# EAGLE design lab3_task1 (EAGLE 6.5.0)
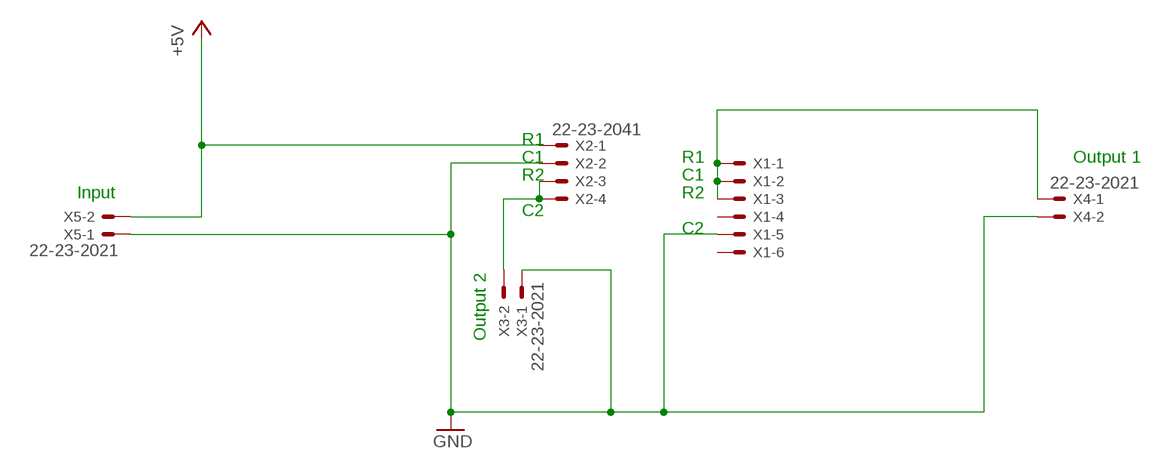
[diagram p0: schematic, sheet 1]

## Parts
X1  22-23-2061  [22-23-2061]
X2  22-23-2041  [22-23-2041]
X3  22-23-2021  [22-23-2021]
X4  22-23-2021  [22-23-2021]
X5  22-23-2021  [22-23-2021]

## Nets
+5V: X2.1 X5.2
GND: X1.5 X2.2 X3.1 X4.2 X5.1
N$1: X1.1 X1.2 X1.3 X4.1
N$2: X2.3 X2.4 X3.2
Unconnected: X1.4 X1.6

## Notes on the sheet
- R1
- C1 | R1 | Output 1
- R2 | C1
- Input | R2
- C2
- C2
- Output 2

## Library data of the parts
X1 = con-molex:22-23-2061: .100" (2.54mm) Center Header - 6 Pin; MF: MOLEX; MPN: 22-23-2061; OC_FARNELL: 1462922; OC_NEWARK: 27C1933
X2 = con-molex:22-23-2041: .100" (2.54mm) Center Header - 4 Pin; MF: MOLEX; MPN: 22-23-2041; OC_FARNELL: 1462920; OC_NEWARK: 38C0355
X3-X5 = con-molex:22-23-2021: .100" (2.54mm) Center Header - 2 Pin; MF: MOLEX; MPN: 22-23-2021; OC_FARNELL: 1462926; OC_NEWARK: 25C3832

## Board
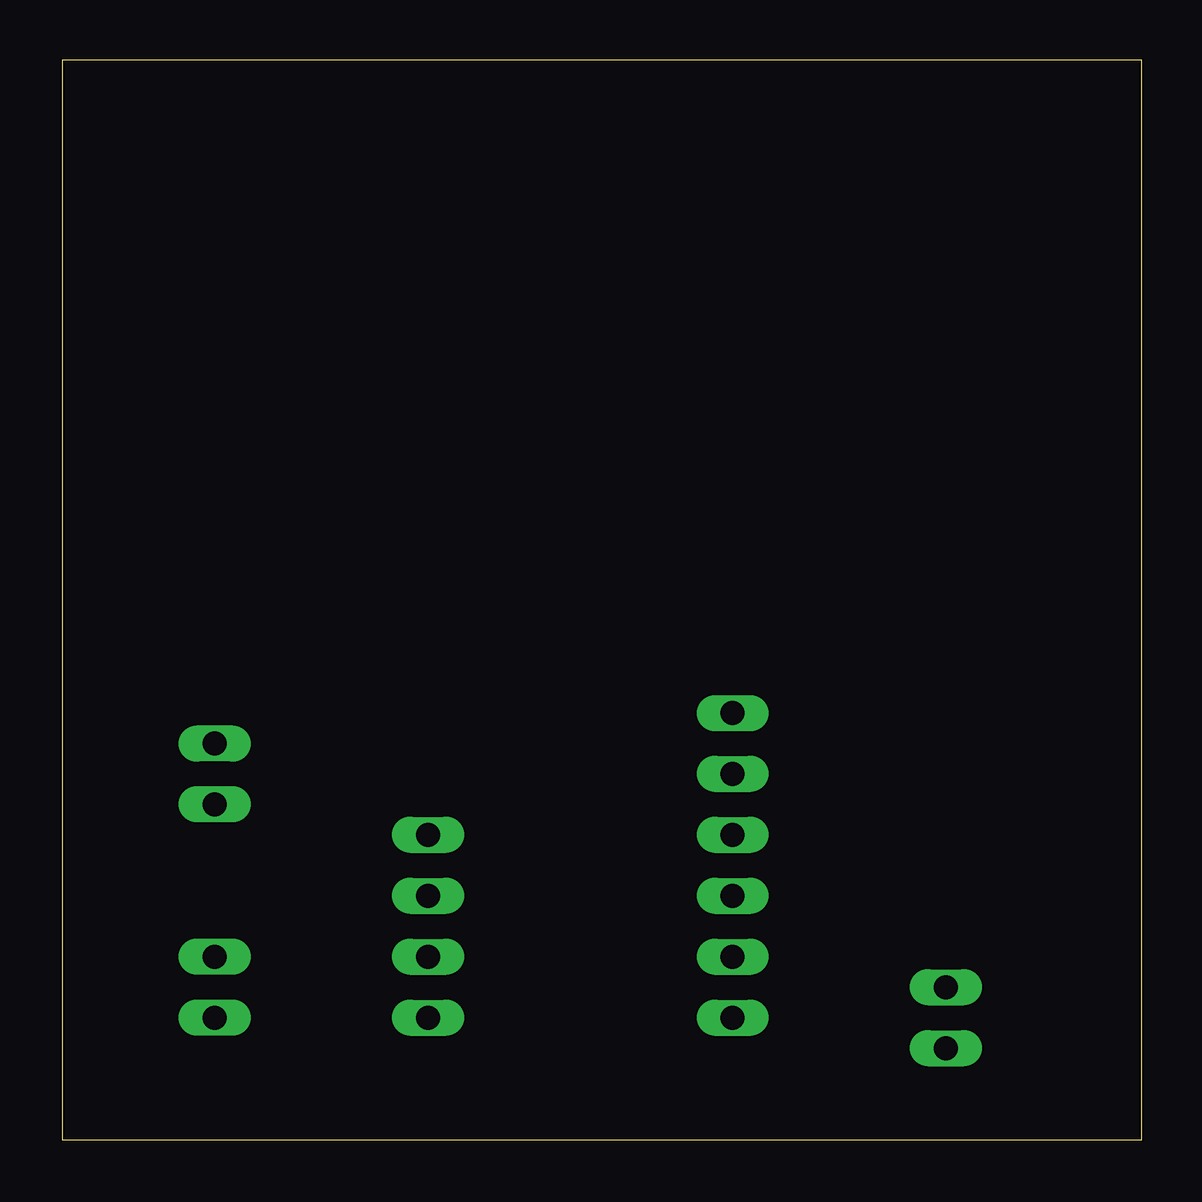
[diagram p1: board, top side]
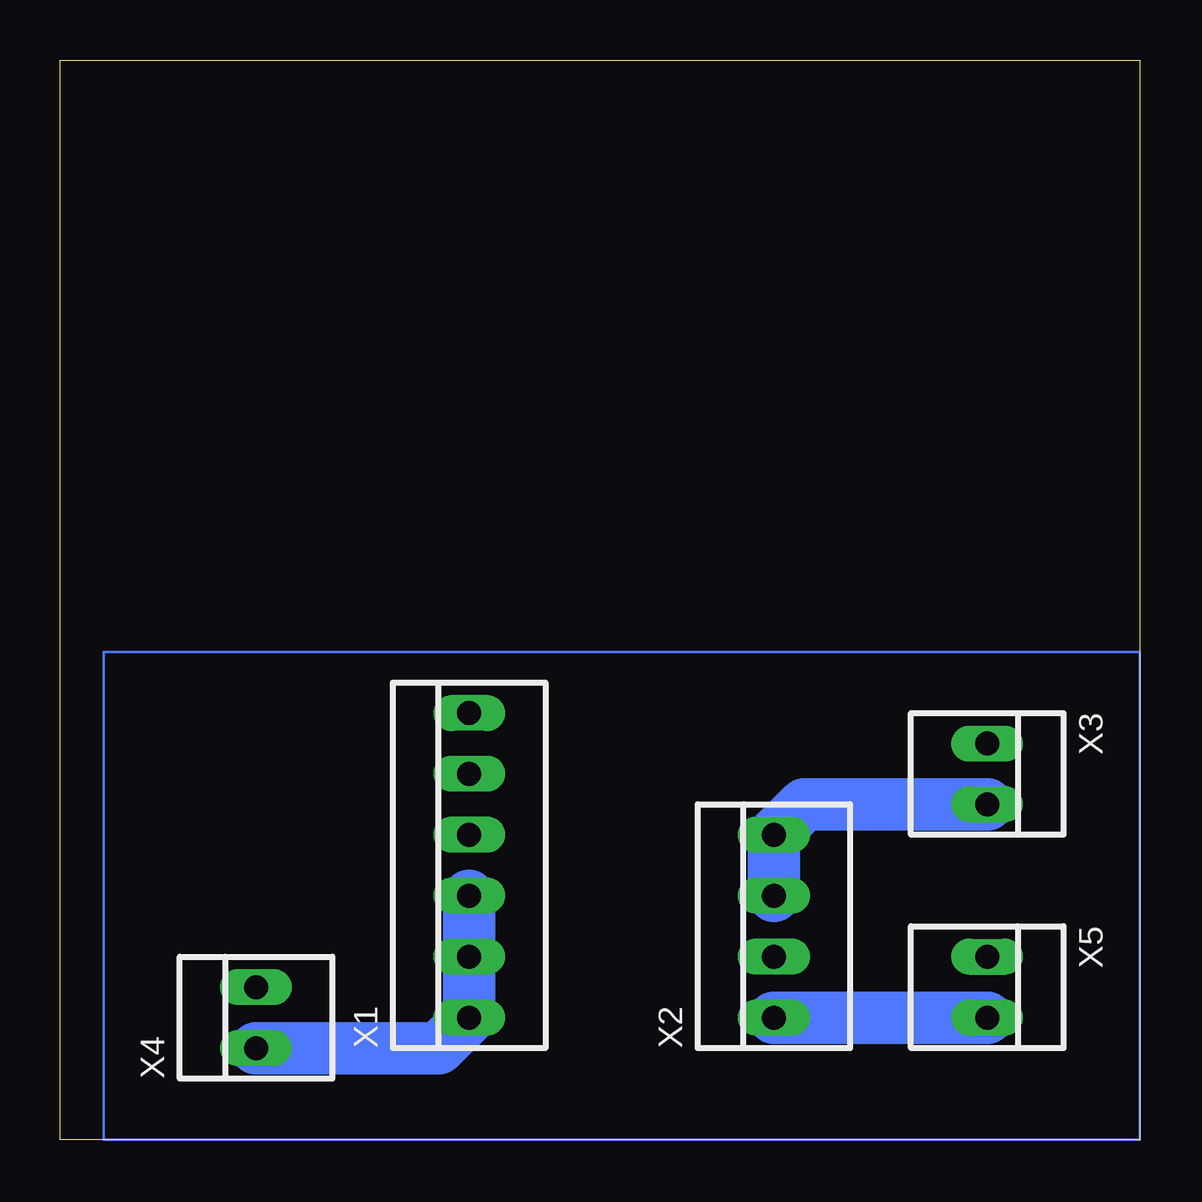
[diagram p2: board, bottom side, seen from below]

Size 45 x 45 mm. Coordinates in mm from the lower left corner, seen from the top.
Outline: 0,0 45,0 45,45 0,45 0,0
Copper layers (1*16): Top 0.035mm / dielectric 1.5mm / Bottom 0.035mm
Design rules "default": minimum track width 10mil, minimum drill 24mil, track to track 8mil, track to pad 8mil, pad to pad 8mil, via to via 8mil, smd to smd 8mil, copper to edge 40mil, drill to drill 8mil, minimum pad ring 10mil, minimum via ring 8mil, stop-mask expansion 4mil, vias tented up to drill 0mil, thermal gap 10mil

### Footprints (pad centres in the part's own frame; a part is rotated, then mirrored left to right if it is on the bottom)
22-23-2061 = drill 1 long: 1 -6.35,0; 2 -3.81,0; 3 -1.27,0; 4 1.27,0; 5 3.81,0; 6 6.35,0
22-23-2041 = drill 1 long: 1 -3.81,0; 2 -1.27,0; 3 1.27,0; 4 3.81,0
22-23-2021 = drill 1 long: 1 -1.27,0; 2 1.27,0

### Placement (x,y rotation side)
X1  27.94,11.43 90 bottom
X2  15.24,8.89 90 bottom
X3  6.35,15.24 270 bottom
X4  36.83,5.08 90 bottom
X5  6.35,6.35 270 bottom

### Tracks (layer width: path | path; a pad name or v marks a point on that pad's centre or on a via)
+5V
  Bottom 2.184: X5.2 X2.1
N$1
  Bottom 2.184: X4.1 29.21,3.81 X1.1 X1.2 X1.3
N$2
  Bottom 2.184: X2.3 X2.4 13.97,13.97 X3.2
(copper drawn outside any net)
  shapes: Bottom area x1